# Altium project 175-00008 rev 3, M2 Focus Drive.PrjPCB
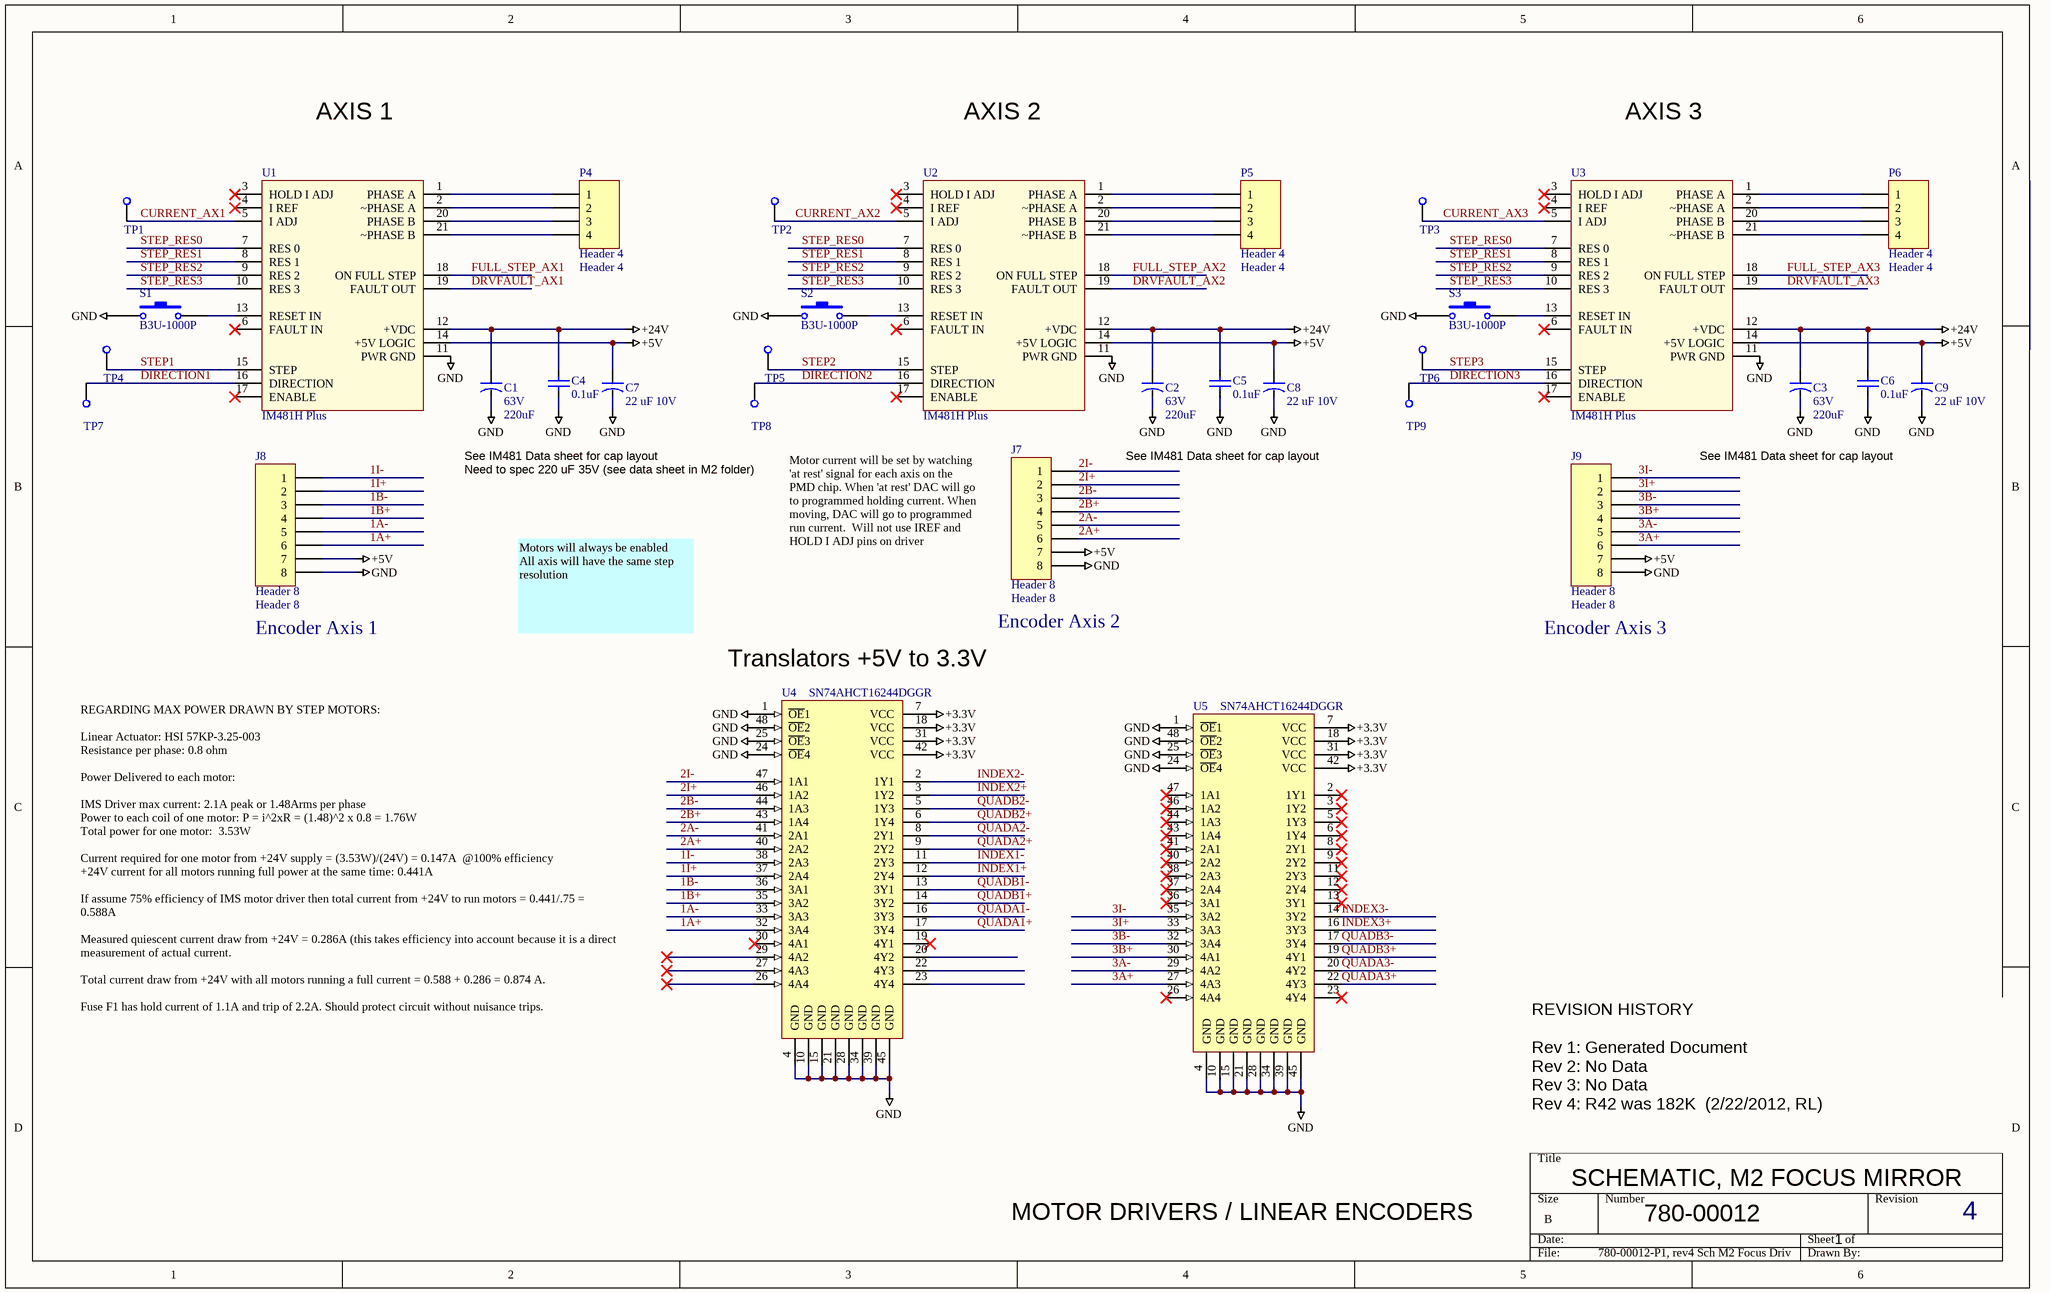
[diagram p0: 780-00012-P1, rev4 Sch M2 Focus Drive.SchDoc]
2 sheets, 80 parts. Net scope: global (net labels, ports and power ports of the same name join across sheets).
Board file: 175-00008 rev 3, PCB, M2 Focus Drive.PcbDoc
Sheets:
  780-00012-P1, rev4 Sch M2 Focus Drive.SchDoc
  780-00012-P2, rev4 Sch M2 Focus Drive.SchDoc

## Sheet 780-00012-P1, rev4 Sch M2 Focus Drive.SchDoc
size B; SheetNumber: 1; SheetTotal: 4; PageSetup: Record=PageOptions|CenterHorizontal=True|CenterVertical=True|PrintScale=1.09|XCorrection=1.00|YCorrection=1.00|PrintKind=0|BorderSize=5000000|LeftOffset=0|BottomOffset=0|Orientation=2|PaperLength=1000|PaperWidth=1000|Scale=100|PaperSource=7|PrintQuality=-4|MediaType=1|DitherType=10|PaperKind=Tabloid|PrintScaleMode=1

### Parts
C1  63V  value 220uF  [CAP 220uF 63V]
C2  63V  value 220uF  [CAP 220uF 63V]
C3  63V  value 220uF  [CAP 220uF 63V]
C4  value 0.1uF  [SMD_0805]  (hidden comment: Cap SMD)
C5  value 0.1uF  [SMD_0805]  (hidden comment: Cap SMD)
C6  value 0.1uF  [SMD_0805]  (hidden comment: Cap SMD)
C7  value 22 uF 10V  [SMD_CAP_3216]  (hidden comment: 16V)
C8  value 22 uF 10V  [SMD_CAP_3216]  (hidden comment: 16V)
C9  value 22 uF 10V  [SMD_CAP_3216]  (hidden comment: 16V)
J7  Header 8  [HDR1X8 for IDC]
J8  Header 8  [HDR1X8 for IDC]
J9  Header 8  [HDR1X8 for IDC]
P4  Header 4  [HDR1X4 for IDC]
P5  Header 4  [HDR1X4 for IDC]
P6  Header 4  [HDR1X4 for IDC]
S1  B3U-1000P  [B3U-1000P]
S2  B3U-1000P  [B3U-1000P]
S3  B3U-1000P  [B3U-1000P]
TP1  Test Point SMD  [SMD_TEST POINT]  (value not drawn)
TP2  Test Point SMD  [SMD_TEST POINT]  (value not drawn)
TP3  Test Point SMD  [SMD_TEST POINT]  (value not drawn)
TP4  Test Point SMD  [SMD_TEST POINT]  (value not drawn)
TP5  Test Point SMD  [SMD_TEST POINT]  (value not drawn)
TP6  Test Point SMD  [SMD_TEST POINT]  (value not drawn)
TP7  Test Point SMD  [SMD_TEST POINT]  (value not drawn)
TP8  Test Point SMD  [SMD_TEST POINT]  (value not drawn)
TP9  Test Point SMD  [SMD_TEST POINT]  (value not drawn)
U1  IM481H Plus  [IM481H Vertical]
U2  IM481H Plus  [IM481H Vertical]
U3  IM481H Plus  [IM481H Vertical]
U4  SN74AHCT16244DGGR  [DGG048_N]
U5  SN74AHCT16244DGGR  [DGG048_N]

### Nets
+3.3V: U4.7(VCC) U4.18(VCC) U4.31(VCC) U4.42(VCC) U5.7(VCC) U5.18(VCC) U5.31(VCC) U5.42(VCC)
+5V: C7.1 C8.1 C9.1 J7.7 J8.7 J9.7 U1.14(+5V_LOGIC) U2.14(+5V_LOGIC) U3.14(+5V_LOGIC)
+24V: C1.1 C2.1 C3.1 C4.2 C5.2 C6.2 U1.12(+VDC) U2.12(+VDC) U3.12(+VDC)
GND: C1.2 C2.2 C3.2 C4.1 C5.1 C6.1 C7.2 C8.2 C9.2 J7.8 J8.8 J9.8 S1.1 S2.1 S3.1 U1.11(PWR_GND) U2.11(PWR_GND) U3.11(PWR_GND) U4.1(~{OE}1) U4.4(GND) U4.10(GND) U4.15(GND) U4.21(GND) U4.24(~{OE}4) U4.25(~{OE}3) U4.28(GND) U4.34(GND) U4.39(GND) U4.45(GND) U4.48(~{OE}2) U5.1(~{OE}1) U5.4(GND) U5.10(GND) U5.15(GND) U5.21(GND) U5.24(~{OE}4) U5.25(~{OE}3) U5.28(GND) U5.34(GND) U5.39(GND) U5.45(GND) U5.48(~{OE}2)
1A+: J8.6 U4.32(3A4)
1A-: J8.5 U4.33(3A3)
1B+: J8.4 U4.35(3A2)
1B-: J8.3 U4.36(3A1)
1I+: J8.2 U4.37(2A4)
1I-: J8.1 U4.38(2A3)
2A+: J7.6 U4.40(2A2)
2A-: J7.5 U4.41(2A1)
2B+: J7.4 U4.43(1A4)
2B-: J7.3 U4.44(1A3)
2I+: J7.2 U4.46(1A2)
2I-: J7.1 U4.47(1A1)
3A+: J9.6 U5.27(4A3)
3A-: J9.5 U5.29(4A2)
3B+: J9.4 U5.30(4A1)
3B-: J9.3 U5.32(3A4)
3I+: J9.2 U5.33(3A3)
3I-: J9.1 U5.35(3A2)
CURRENT_AX1: TP1.1(TP) U1.5(I_ADJ)
CURRENT_AX2: TP2.1(TP) U2.5(I_ADJ)
CURRENT_AX3: TP3.1(TP) U3.5(I_ADJ)
DIRECTION1: TP7.1(TP) U1.16(DIRECTION)
DIRECTION2: TP8.1(TP) U2.16(DIRECTION)
DIRECTION3: TP9.1(TP) U3.16(DIRECTION)
DRVFAULT_AX1: U1.19(FAULT_OUT)
DRVFAULT_AX2: U2.19(FAULT_OUT)
DRVFAULT_AX3: U3.19(FAULT_OUT)
FULL_STEP_AX1: U1.18(ON_FULL_STEP)
FULL_STEP_AX2: U2.18(ON_FULL_STEP)
FULL_STEP_AX3: U3.18(ON_FULL_STEP)
INDEX1+: U4.12(2Y4)
INDEX1-: U4.11(2Y3)
INDEX2+: U4.3(1Y2)
INDEX2-: U4.2(1Y1)
INDEX3+: U5.16(3Y3)
INDEX3-: U5.14(3Y2)
QUADA1+: U4.17(3Y4)
QUADA1-: U4.16(3Y3)
QUADA2+: U4.9(2Y2)
QUADA2-: U4.8(2Y1)
QUADA3+: U5.22(4Y3)
QUADA3-: U5.20(4Y2)
QUADB1+: U4.14(3Y2)
QUADB1-: U4.13(3Y1)
QUADB2+: U4.6(1Y4)
QUADB2-: U4.5(1Y3)
QUADB3+: U5.19(4Y1)
QUADB3-: U5.17(3Y4)
STEP1: TP4.1(TP) U1.15(STEP)
STEP2: TP5.1(TP) U2.15(STEP)
STEP3: TP6.1(TP) U3.15(STEP)
STEP_RES0: U1.7(RES_0) U2.7(RES_0) U3.7(RES_0)
STEP_RES1: U1.8(RES_1) U2.8(RES_1) U3.8(RES_1)
STEP_RES2: U1.9(RES_2) U2.9(RES_2) U3.9(RES_2)
STEP_RES3: U1.10(RES_3) U2.10(RES_3) U3.10(RES_3)
NetP4_1: P4.1 U1.1(PHASE_A)
NetP4_2: P4.2 U1.2(~PHASE_A)
NetP4_3: P4.3 U1.20(PHASE_B)
NetP4_4: P4.4 U1.21(~PHASE_B)
NetP5_1: P5.1 U2.1(PHASE_A)
NetP5_2: P5.2 U2.2(~PHASE_A)
NetP5_3: P5.3 U2.20(PHASE_B)
NetP5_4: P5.4 U2.21(~PHASE_B)
NetP6_1: P6.1 U3.1(PHASE_A)
NetP6_2: P6.2 U3.2(~PHASE_A)
NetP6_3: P6.3 U3.20(PHASE_B)
NetP6_4: P6.4 U3.21(~PHASE_B)
NetS1_2: S1.2 U1.13(RESET_IN)
NetS2_2: S2.2 U2.13(RESET_IN)
NetS3_2: S3.2 U3.13(RESET_IN)

Not connected (* = marked no-connect by the designer): U1 3(HOLD_I_ADJ)* 4(I_REF)* 6(FAULT_IN)* 17(ENABLE)*; U2 3(HOLD_I_ADJ)* 4(I_REF)* 6(FAULT_IN)* 17(ENABLE)*; U3 3(HOLD_I_ADJ)* 4(I_REF)* 6(FAULT_IN)* 17(ENABLE)*; U4 19(4Y1)* 20(4Y2) 22(4Y3) 23(4Y4) 26(4A4)* 27(4A3)* 29(4A2)* 30(4A1)*; U5 2(1Y1)* 3(1Y2)* 5(1Y3)* 6(1Y4)* 8(2Y1)* 9(2Y2)* 11(2Y3)* 12(2Y4)* 13(3Y1)* 23(4Y4)* 26(4A4)* 36(3A1)* 37(2A4)* 38(2A3)* 40(2A2)* 41(2A1)* 43(1A4)* 44(1A3)* 46(1A2)* 47(1A1)*

### Notes on the sheet
- AXIS 1
- AXIS 2
- AXIS 3
- See IM481 Data sheet for cap layout
- Need to spec 220 uF 35V (see data sheet in M2 folder)
- Motor current will be set by watching 'at rest' signal for each axis on the PMD chip. When 'at rest' DAC will go to programmed holding current. When moving, DAC will go to programmed run current.  Will not use IREF and HOLD I ADJ pins on driver
- (near J8) Encoder Axis 1
- Motors will always be enabled
  All axis will have the same step resolution
- (near J7) Encoder Axis 2
- (near J9) Encoder Axis 3
- (near U4) Translators +5V to 3.3V
- REGARDING MAX POWER DRAWN BY STEP MOTORS:
  Linear Actuator: HSI 57KP-3.25-003
  Resistance per phase: 0.8 ohm
  Power Delivered to each motor:
  IMS Driver max current: 2.1A peak or 1.48Arms per phase
  Power to each coil of one motor: P = i^2xR = (1.48)^2 x 0.8 = 1.76W
  Total power for one motor:  3.53W
  Current required for one motor from +24V supply = (3.53W)/(24V) = 0.147A  @100% efficiency
  +24V current for all motors running full power at the same time: 0.441A
  If assume 75% efficiency of IMS motor driver then total current from +24V to run motors = 0.441/.75 = 0.588A
  Measured quiescent current draw from +24V = 0.286A (this takes efficiency into account because it is a direct measurement of actual current.
  Total current draw from +24V with all motors running a full current = 0.588 + 0.286 = 0.874 A.
  Fuse F1 has hold current of 1.1A and trip of 2.2A. Should protect circuit without nuisance trips.
- REVISION HISTORY
  Rev 1: Generated Document
  Rev 2: No Data
  Rev 3: No Data
  Rev 4: R42 was 182K  (2/22/2012, RL)
- MOTOR DRIVERS / LINEAR ENCODERS
- SCHEMATIC, M2 FOCUS MIRROR
- 780-00012
- 1
- 4

### Library data of the parts
C1-C3 = Cap 220uF, 63V: CAP 220UF 63V ELECT MVH SMD; Manufacturer: United Chemi-Con; Manuf p/n: EMVH630ARA221MKG5S; Vendor: DigiKey; Vendor p/n: 565-2337-1-ND; Vendor Mult.: 5; LCO p/n: 120-00041; To Do list: New LCO pn; COST: 2.10
C4-C6 = Cap SMD: Capacitor; LCO p/n: 120-00002
C7-C9 = Cap Tant 16V: outline 3.2mm x 1.6mm; Manufacturer: KEMET; Manuf p/n: T494A106M016AT; Vendor: DIGIKEY; Vendor p/n: 399-3824-1-ND; Vendor Mult.: 1; LCO p/n: 120-00001; COST: 0.78
J7-J9 = Header 8: Header, 8-Pin; LCO p/n: 125-00047; VALUE: Header 8
P4-P6 = Header 4: Header, 4-Pin; LCO p/n: 125-00037; VALUE: Header 4
S1-S3 = SW-PB: Switch; Manufacturer: Omron Electronics; Vendor: DIGIKEY; Vendor Mult.: 1; Vendor p/n: SW1020CT-ND; Value: SW PB; LCO p/n: 185-00005; COST: 0.96; Manuf p/n: B3U-1000P
TP1-TP9 = Test Point SMD: SMD loop test point; LCO p/n: 160-00001; VALUE: Test Point SMD
U1-U3 = IM481H Plus: Hybrid stepper motor driver; LCO p/n: 170-00001; VALUE: IM481H
U4 U5 = SN74AHCT16244DGGR: 16-Bit Buffer/Driver with 3-State Outputs; LCO p/n: 150-00065

## Sheet 780-00012-P2, rev4 Sch M2 Focus Drive.SchDoc
size B; SheetNumber: 2; SheetTotal: 4; PageSetup: Record=PageOptions|CenterHorizontal=True|CenterVertical=True|PrintScale=1.09|XCorrection=1.00|YCorrection=1.00|PrintKind=0|BorderSize=5000000|LeftOffset=0|BottomOffset=0|Orientation=2|PaperLength=1000|PaperWidth=1000|Scale=100|PaperSource=7|PrintQuality=-4|MediaType=1|DitherType=10|PaperKind=Tabloid 11 x 17in|PrintScaleMode=1
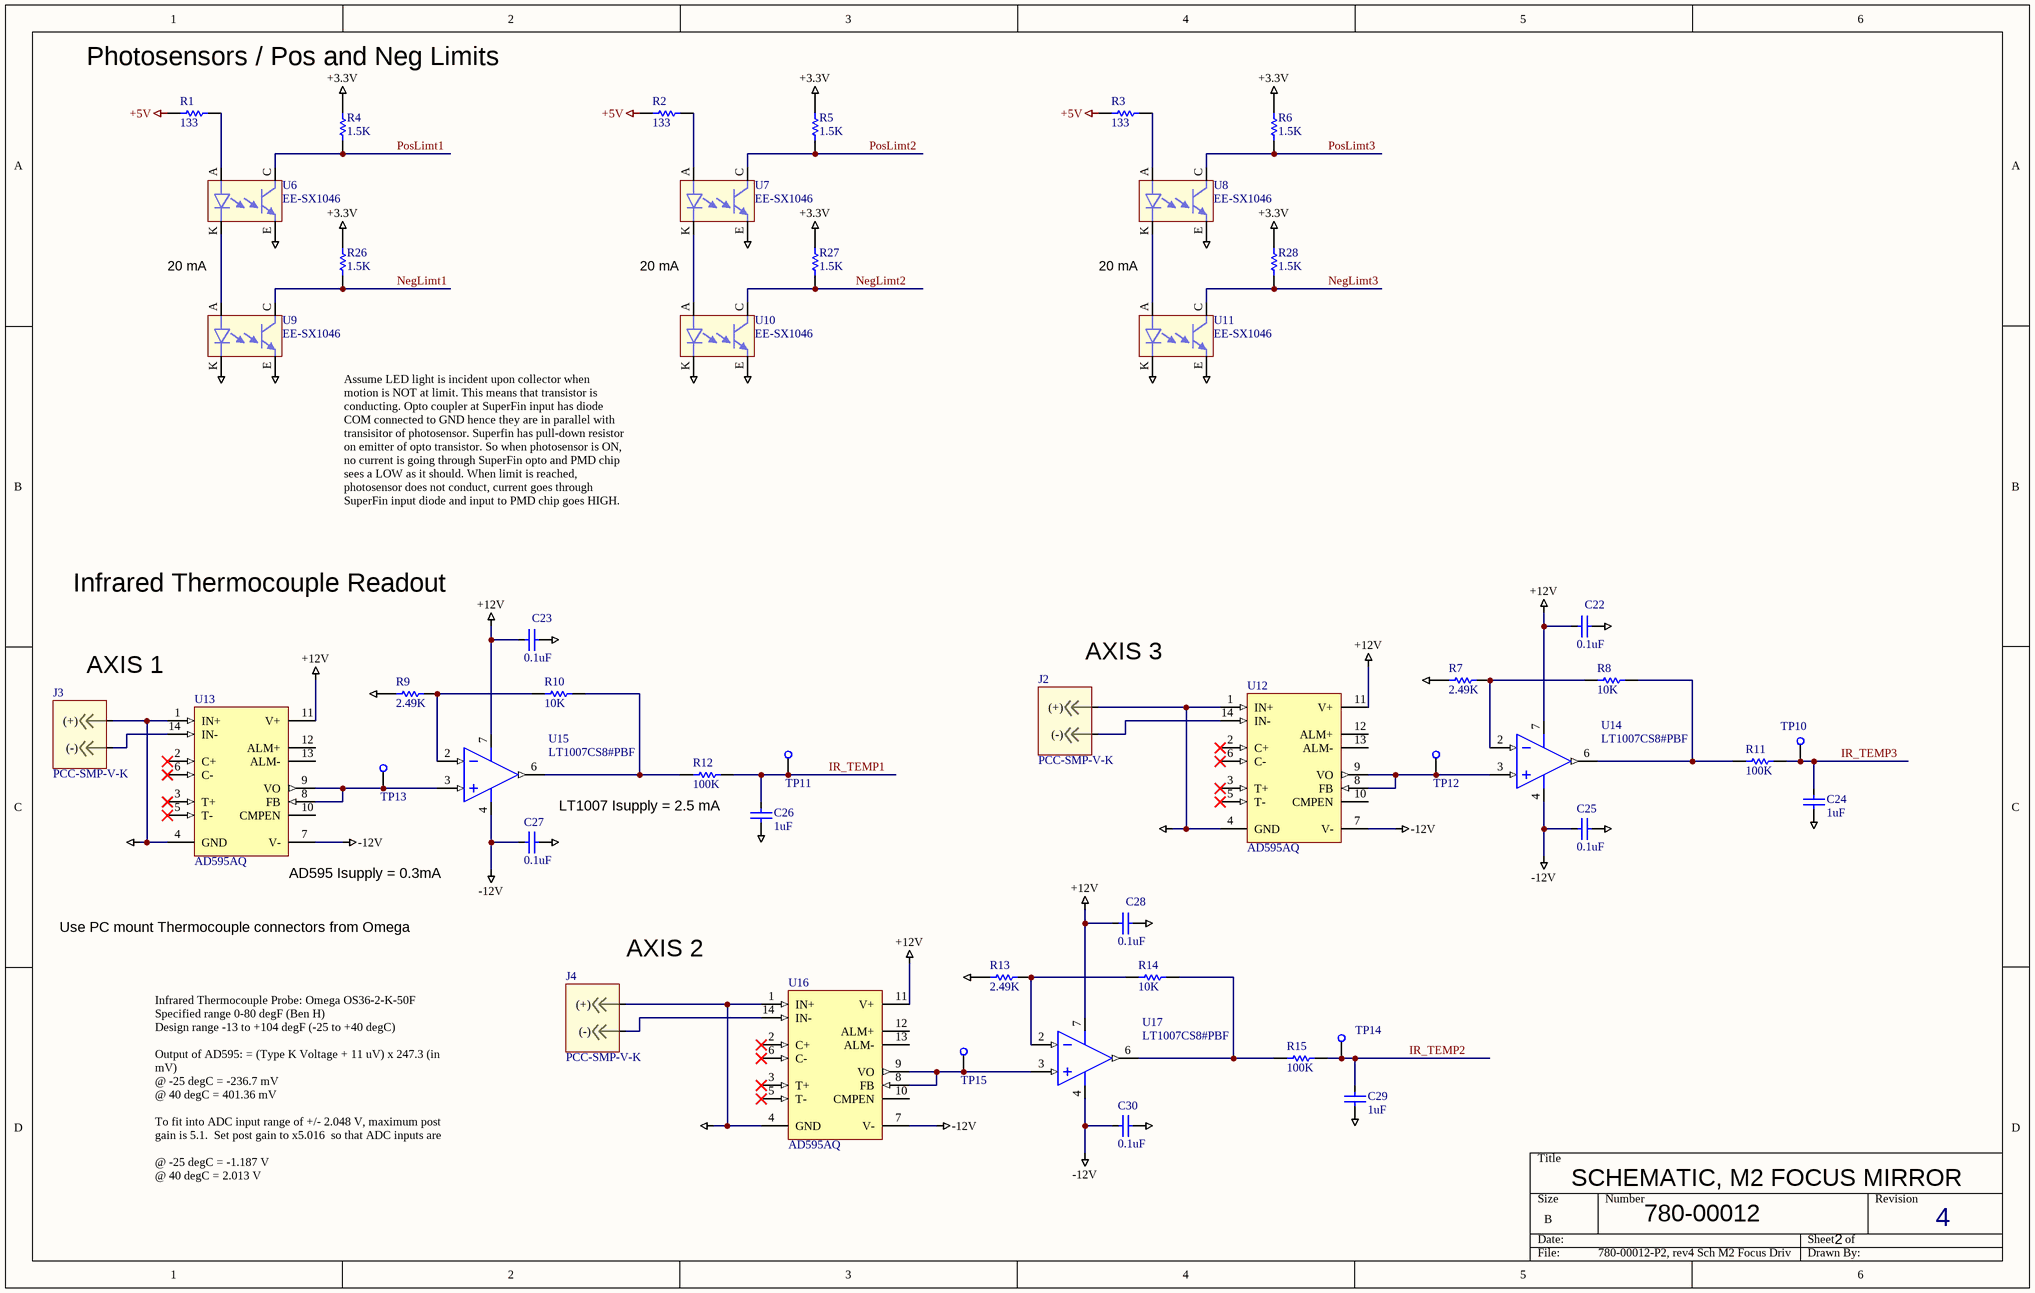
[diagram p1: 780-00012-P2, rev4 Sch M2 Focus Drive.SchDoc]

### Parts
C22  value 0.1uF  [SMD_0805]  (hidden comment: Cap SMD)
C23  value 0.1uF  [SMD_0805]  (hidden comment: Cap SMD)
C24  value 1uF  [SMD_0805]  (hidden comment: Cap SMD)
C25  value 0.1uF  [SMD_0805]  (hidden comment: Cap SMD)
C26  value 1uF  [SMD_0805]  (hidden comment: Cap SMD)
C27  value 0.1uF  [SMD_0805]  (hidden comment: Cap SMD)
C28  value 0.1uF  [SMD_0805]  (hidden comment: Cap SMD)
C29  value 1uF  [SMD_0805]  (hidden comment: Cap SMD)
C30  value 0.1uF  [SMD_0805]  (hidden comment: Cap SMD)
J2  PCC-SMP-V-K  [THERMOCOUPLE]
J3  PCC-SMP-V-K  [THERMOCOUPLE]
J4  PCC-SMP-V-K  [THERMOCOUPLE]
R1  value 133  [SMD_0805]  (hidden comment: Res 0805)
R2  value 133  [SMD_0805]  (hidden comment: Res 0805)
R3  value 133  [SMD_0805]  (hidden comment: Res 0805)
R4  value 1.5K  [SMD_0805]  (hidden comment: Res 0805)
R5  value 1.5K  [SMD_0805]  (hidden comment: Res 0805)
R6  value 1.5K  [SMD_0805]  (hidden comment: Res 0805)
R7  value 2.49K  [SMD_0805]  (hidden comment: Res 0805)
R8  value 10K  [SMD_0805]  (hidden comment: Res 0805)
R9  value 2.49K  [SMD_0805]  (hidden comment: Res 0805)
R10  value 10K  [SMD_0805]  (hidden comment: Res 0805)
R11  value 100K  [SMD_0805]  (hidden comment: Res 0805)
R12  value 100K  [SMD_0805]  (hidden comment: Res 0805)
R13  value 2.49K  [SMD_0805]  (hidden comment: Res 0805)
R14  value 10K  [SMD_0805]  (hidden comment: Res 0805)
R15  value 100K  [SMD_0805]  (hidden comment: Res 0805)
R26  value 1.5K  [SMD_0805]  (hidden comment: Res 0805)
R27  value 1.5K  [SMD_0805]  (hidden comment: Res 0805)
R28  value 1.5K  [SMD_0805]  (hidden comment: Res 0805)
TP10  Test Point SMD  [SMD_TEST POINT]  (value not drawn)
TP11  Test Point SMD  [SMD_TEST POINT]  (value not drawn)
TP12  Test Point SMD  [SMD_TEST POINT]  (value not drawn)
TP13  Test Point SMD  [SMD_TEST POINT]  (value not drawn)
TP14  Test Point SMD  [SMD_TEST POINT]  (value not drawn)
TP15  Test Point SMD  [SMD_TEST POINT]  (value not drawn)
U6  EE-SX1046  [Photo-sensor]
U7  EE-SX1046  [Photo-sensor]
U8  EE-SX1046  [Photo-sensor]
U9  EE-SX1046  [Photo-sensor]
U10  EE-SX1046  [Photo-sensor]
U11  EE-SX1046  [Photo-sensor]
U12  AD595AQ  [Q-14_A]
U13  AD595AQ  [Q-14_A]
U14  LT1007CS8#PBF  [S8_M]
U15  LT1007CS8#PBF  [S8_M]
U16  AD595AQ  [Q-14_A]
U17  LT1007CS8#PBF  [S8_M]

### Nets
+3.3V: R4.2 R5.2 R6.2 R26.2 R27.2 R28.2
+5V: R1.2 R2.2 R3.2
+12V: C22.2 C23.2 C28.2 U12.11(V+) U13.11(V+) U14.7(V+) U15.7(V+) U16.11(V+) U17.7(V+)
-12V: C25.2 C27.2 C30.2 U12.7(V-) U13.7(V-) U14.4(V-) U15.4(V-) U16.7(V-) U17.4(V-)
GND: C22.1 C23.1 C24.1 C25.1 C26.1 C27.1 C28.1 C29.1 C30.1 J2.1((+)) J3.1((+)) J4.1((+)) R7.1 R9.1 R13.1 U6.E(emitter) U7.E(emitter) U8.E(emitter) U9.E(emitter) U9.K(cathode) U10.E(emitter) U10.K(cathode) U11.E(emitter) U11.K(cathode) U12.1(IN+) U12.4(GND) U13.1(IN+) U13.4(GND) U16.1(IN+) U16.4(GND)
IR_TEMP1: C26.2 R12.2 TP11.1(TP)
IR_TEMP2: C29.2 R15.2 TP14.1(TP)
IR_TEMP3: C24.2 R11.2 TP10.1(TP)
NegLimt1: R26.1 U9.C(collector)
NegLimt2: R27.1 U10.C(collector)
NegLimt3: R28.1 U11.C(collector)
PosLimt1: R4.1 U6.C(collector)
PosLimt2: R5.1 U7.C(collector)
PosLimt3: R6.1 U8.C(collector)
NetJ2_2: J2.2((-)) U12.14(IN-)
NetJ3_2: J3.2((-)) U13.14(IN-)
NetJ4_2: J4.2((-)) U16.14(IN-)
NetR1_1: R1.1 U6.A(anode)
NetR2_1: R2.1 U7.A(anode)
NetR3_1: R3.1 U8.A(anode)
NetR7_2: R7.2 R8.1 U14.2(IN-)
NetR8_2: R8.2 R11.1 U14.6(OUT)
NetR9_2: R9.2 R10.1 U15.2(IN-)
NetR10_2: R10.2 R12.1 U15.6(OUT)
NetR13_2: R13.2 R14.1 U17.2(IN-)
NetR14_2: R14.2 R15.1 U17.6(OUT)
NetTP12_1: TP12.1(TP) U12.8(FB) U12.9(VO) U14.3(IN+)
NetTP13_1: TP13.1(TP) U13.8(FB) U13.9(VO) U15.3(IN+)
NetTP15_1: TP15.1(TP) U16.8(FB) U16.9(VO) U17.3(IN+)
NetU6_K: U6.K(cathode) U9.A(anode)
NetU7_K: U7.K(cathode) U10.A(anode)
NetU8_K: U8.K(cathode) U11.A(anode)

Not connected (* = marked no-connect by the designer): U12 2(C+)* 3(T+)* 5(T-)* 6(C-)* 10(CMPEN) 12(ALM+) 13(ALM-); U13 2(C+)* 3(T+)* 5(T-)* 6(C-)* 10(CMPEN) 12(ALM+) 13(ALM-); U14 1(VOSTRIM) 5(NC) 8(VOSTRIM); U15 1(VOSTRIM) 5(NC) 8(VOSTRIM); U16 2(C+)* 3(T+)* 5(T-)* 6(C-)* 10(CMPEN) 12(ALM+) 13(ALM-); U17 1(VOSTRIM) 5(NC) 8(VOSTRIM)

### Notes on the sheet
- Photosensors / Pos and Neg Limits
- 20 mA
- Assume LED light is incident upon collector when motion is NOT at limit. This means that transistor is conducting. Opto coupler at SuperFin input has diode COM connected to GND hence they are in parallel with transisitor of photosensor. Superfin has pull-down resistor on emitter of opto transistor. So when photosensor is ON, no current is going through SuperFin opto and PMD chip sees a LOW as it should. When limit is reached, photosensor does not conduct, current goes through SuperFin input diode and input to PMD chip goes HIGH.
- Infrared Thermocouple Readout
- AXIS 1
- (near J2) AXIS 3
- LT1007 Isupply = 2.5 mA
- (near U13) AD595 Isupply = 0.3mA
- Use PC mount Thermocouple connectors from Omega
- (near J4) AXIS 2
- Infrared Thermocouple Probe: Omega OS36-2-K-50F
  Specified range 0-80 degF (Ben H)
  Design range -13 to +104 degF (-25 to +40 degC)
  Output of AD595: = (Type K Voltage + 11 uV) x 247.3 (in mV)
  @ -25 degC = -236.7 mV
  @ 40 degC = 401.36 mV
  To fit into ADC input range of +/- 2.048 V, maximum post gain is 5.1.  Set post gain to x5.016  so that ADC inputs are
  @ -25 degC = -1.187 V
  @ 40 degC = 2.013 V
- SCHEMATIC, M2 FOCUS MIRROR
- 780-00012
- 2
- 4

### Library data of the parts
C22 C23 C25 C27 C28 C30 = Cap SMD: Capacitor; LCO p/n: 120-00002
C24 C26 C29 = Cap SMD: Capacitor; LCO p/n: 120-00006
J2-J4 = Thermocouple Connector: T/C Conn PCB mount vertical; LCO p/n: 125-00042
R1-R3 = Res SMD: Resistor 0805; Manufacturer: Vishay/Dale; Manuf p/n: CRCW0805133FKEA; Vendor: DIGIKEY; Vendor p/n: 541-133CCT-ND; Vendor Mult.: 10; LCO p/n: 181-01330; COST: 0.09
R4-R6 R26-R28 = Res SMD: Resistor 0805; Manufacturer: Vishay/Dale; Manuf p/n: CRCW08051.5KFKEA; Vendor: DIGIKEY; Vendor p/n: 541-1.5KCCT-ND; Vendor Mult.: 10; LCO p/n: 181-01501; COST: 0.09
R7 R9 R13 = Res SMD: Resistor 0805; Manufacturer: Vishay/Dale; Manuf p/n: CRCW08052.49KFKEA; Vendor: DIGIKEY; Vendor p/n: 541-2.49KCCT-ND; Vendor Mult.: 10; LCO p/n: 181-02491; COST: 0.09
R8 R10 R14 = Res SMD: Resistor 0805; Manufacturer: Vishay/Dale; Manuf p/n: CRCW080510KFKEA; Vendor: DIGIKEY; Vendor p/n: 541-10KCCT-ND; Vendor Mult.: 10; LCO p/n: 181-01002; COST: 0.09
R11 R12 R15 = Res SMD: Resistor 0805; Manufacturer: Vishay/Dale; Manuf p/n: CRCW0805100KFKEA; Vendor: DIGIKEY; Vendor p/n: 541-100KCCT-ND; Vendor Mult.: 10; LCO p/n: 181-01003; COST: 0.09
TP10-TP15 = Test Point SMD: SMD loop test point; LCO p/n: 160-00001; VALUE: Test Point SMD
U6-U11 = Photo-sensor: Omron EE-SX1046; LCO p/n: 135-00001
U12 U13 U16 = AD595AQ: Monolithic Thermocouple Amplifier with Cold Junction Compensation; Manufacturer: Analog Devices; LCO p/n: 150-00066; Vendor: Digi-Key; Vendor Mult.: 1; Vendor p/n: AD595AQ-ND; COST: 12.35; Manuf p/n: AD595AQ; VALUE: AD595AQ
U14 U15 U17 = LT1007CS8#PBF: Low Noise BJT input opamp; Manufacturer: Linear Tech; LCO p/n: 150-00067; VALUE: LT1007; Vendor: DigiKey; Vendor Mult.: 1; Vendor p/n: LT1007CS8#PBF-ND; COST: 4.13; Manuf p/n: LT1007CS8#PBF

## Nets that join several sheets
+3.3V: 780-00012-P1, rev4 Sch M2 Focus Drive (8 pins), 780-00012-P2, rev4 Sch M2 Focus Drive (6 pins)
+5V: 780-00012-P1, rev4 Sch M2 Focus Drive (9 pins), 780-00012-P2, rev4 Sch M2 Focus Drive (R1.2 R2.2 R3.2)
GND: 780-00012-P1, rev4 Sch M2 Focus Drive (42 pins), 780-00012-P2, rev4 Sch M2 Focus Drive (30 pins)